# Altium schematic sheet Schematic_2023-08-02.schdoc
size 599 x 400 mm
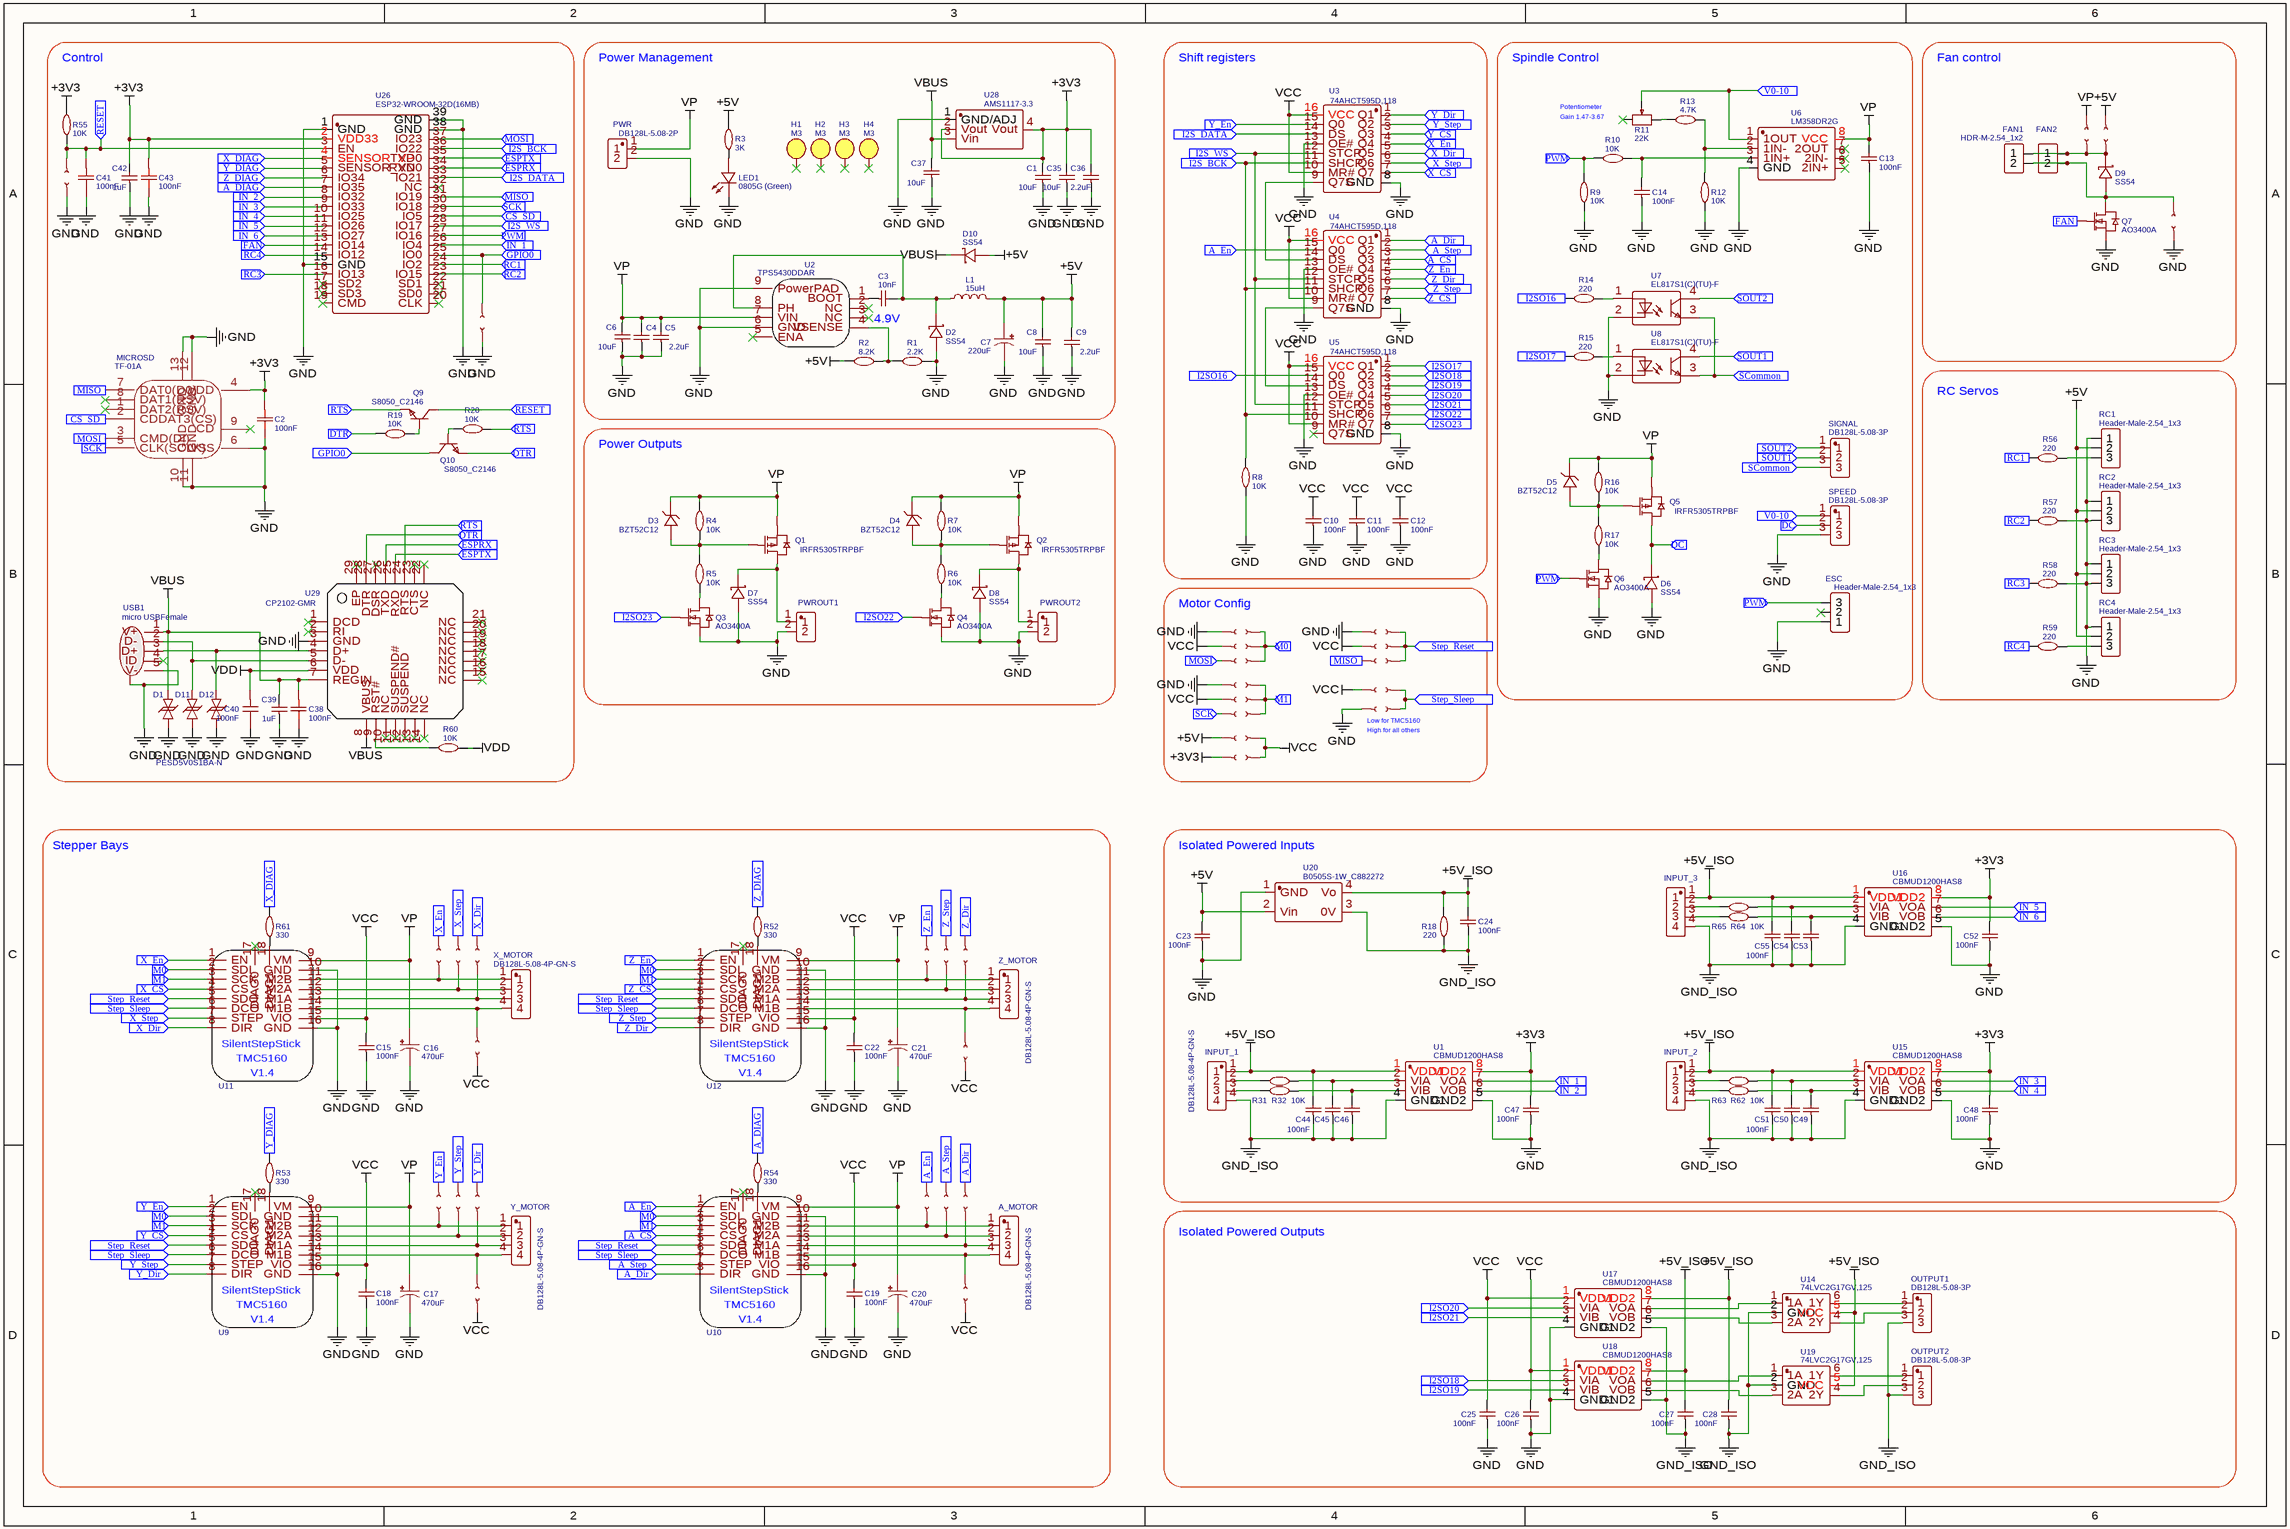
[diagram p0: Schematic_2023-08-02.schdoc]

## Parts
A_MOTOR  DB128L-5.08-4P-GN-S  [CONN-TH_4P-5.00_DB128L-5.0-4P-BU-S]
C1  10uF  [C1206]
C2  100nF  [C0603]
C3  10nF  [C0805]
C4  2.2uF  [C1206]  (value not drawn)
C5  2.2uF  [C1206]
C6  10uF  [C1206]
C7  220uF  [CAP-SMD_L7.3-W4.3-R-RD]
C8  10uF  [C1206]
C9  2.2uF  [C1206]
C10  100nF  [C0805]
C11  100nF  [C0805]
C12  100nF  [C0805]
C13  100nF  [C0805]
C14  100nF  [C0805]
C15  100nF  [C0805]
C16  470uF  [CAP-SMD_BD12.5-L13.0-W13.0-FD]
C17  470uF  [CAP-SMD_BD12.5-L13.0-W13.0-FD]
C18  100nF  [C0805]
C19  100nF  [C0805]
C20  470uF  [CAP-SMD_BD12.5-L13.0-W13.0-FD]
C21  470uF  [CAP-SMD_BD12.5-L13.0-W13.0-FD]
C22  100nF  [C0805]
C23  100nF  [C0805]
C24  100nF  [C0805]
C25  100nF  [C0805]
C26  100nF  [C0805]
C27  100nF  [C0805]
C28  100nF  [C0805]
C35  10uF  [C1206]
C36  2.2uF  [C1206]
C37  10uF  [C1206]
C38  100nF  [C0603]
C39  1uF  [C0603]
C40  100nF  [C0603]
C41  100nF  [C0603]
C42  1uF  [C0603]
C43  100nF  [C0603]
C44  100nF  [C0805]  (value not drawn)
C45  100nF  [C0805]
C46  100nF  [C0805]  (value not drawn)
C47  100nF  [C0805]
C48  100nF  [C0805]
C49  100nF  [C0805]  (value not drawn)
C50  100nF  [C0805]
C51  100nF  [C0805]  (value not drawn)
C52  100nF  [C0805]
C53  100nF  [C0805]  (value not drawn)
C54  100nF  [C0805]
C55  100nF  [C0805]  (value not drawn)
D1  PESD5V0S1BA-N  [SOD-323_L1.8-W1.3-LS2.5-BI]  (value not drawn)
D2  SS54  [SMA_L4.4-W2.8-LS5.4-R-RD]
D3  BZT52C12  [SOD-123_L2.7-W1.6-LS3.7-RD]
D4  BZT52C12  [SOD-123_L2.7-W1.6-LS3.7-RD]
D5  BZT52C12  [SOD-123_L2.7-W1.6-LS3.7-RD]
D6  SS54  [SMA_L4.4-W2.8-LS5.4-R-RD]
D7  SS54  [SMA_L4.4-W2.8-LS5.4-R-RD]
D8  SS54  [SMA_L4.4-W2.8-LS5.4-R-RD]
D9  SS54  [SMA_L4.4-W2.8-LS5.4-R-RD]
D10  SS54  [SMA_L4.4-W2.8-LS5.4-R-RD]
D11  PESD5V0S1BA-N  [SOD-323_L1.8-W1.3-LS2.5-BI]  (value not drawn)
D12  PESD5V0S1BA-N  [SOD-323_L1.8-W1.3-LS2.5-BI]
ESC  Header-Male-2.54_1x3  [HDR-TH_3P-P2.54-V-M-1]
FAN1  HDR-M-2.54_1x2  [HDR-M-2.54_1X2]
FAN2  HDR-M-2.54_1x2  [HDR-M-2.54_1X2]  (value not drawn)
H1  M3  [M3 CHASSIS]
H2  M3  [M3 CHASSIS]
H3  M3  [M3 CHASSIS]
H4  M3  [M3 CHASSIS]
INPUT_1  DB128L-5.08-4P-GN-S  [CONN-TH_4P-5.00_DB128L-5.0-4P-BU-S]
INPUT_2  DB128L-5.08-4P-GN-S  [CONN-TH_4P-5.00_DB128L-5.0-4P-BU-S]  (value not drawn)
INPUT_3  DB128L-5.08-4P-GN-S  [CONN-TH_4P-5.00_DB128L-5.0-4P-BU-S]  (value not drawn)
JP1  JUMPER-PAD-2  [JUMPER_SOLDER_2]  (value not drawn)
JP2  JUMPER-PAD-2  [JUMPER_SOLDER_2]  (value not drawn)
JP3  JUMPER-PAD-2  [JUMPER_SOLDER_2]  (value not drawn)
JP4  JUMPER-PAD-2  [JUMPER_SOLDER_2]  (value not drawn)
JP5  JUMPER-PAD-2  [JUMPER_SOLDER_2]  (value not drawn)
JP6  JUMPER-PAD-2  [JUMPER_SOLDER_2]  (value not drawn)
JP7  JUMPER-PAD-2  [JUMPER_SOLDER_2]  (value not drawn)
JP8  JUMPER-PAD-2  [JUMPER_SOLDER_2]  (value not drawn)
JP9  JUMPER-PAD-2  [JUMPER_SOLDER_2]  (value not drawn)
JP10  JUMPER-PAD-2  [JUMPER_SOLDER_2]  (value not drawn)
JP11  JUMPER-PAD-2  [JUMPER_SOLDER_2]  (value not drawn)
JP12  JUMPER-PAD-2  [JUMPER_SOLDER_2]  (value not drawn)
JP13  JUMPER-PAD-2  [JUMPER_SOLDER_2]  (value not drawn)
JP14  JUMPER-PAD-2  [JUMPER_SOLDER_2]  (value not drawn)
JP15  JUMPER-PAD-2  [JUMPER_SOLDER_2]  (value not drawn)
JP16  JUMPER-PAD-2  [JUMPER_SOLDER_2]  (value not drawn)
JP17  JUMPER-PAD-2  [JUMPER_SOLDER_2]  (value not drawn)
JP18  JUMPER-PAD-2  [JUMPER_SOLDER_2]  (value not drawn)
JP19  JUMPER-PAD-2  [JUMPER_SOLDER_2]  (value not drawn)
JP20  JUMPER-PAD-2  [JUMPER_SOLDER_2]  (value not drawn)
JP21  JUMPER-PAD-2  [JUMPER_SOLDER_2]  (value not drawn)
JP22  JUMPER-PAD-2  [JUMPER_SOLDER_2]  (value not drawn)
JP23  JUMPER-PAD-2  [JUMPER_SOLDER_2]  (value not drawn)
JP24  JUMPER-PAD-2  [JUMPER_SOLDER_2]  (value not drawn)
JP25  JUMPER-PAD-2  [JUMPER_SOLDER_2]  (value not drawn)
JP26  JUMPER-PAD-2  [JUMPER_SOLDER_2]  (value not drawn)
JP27  JUMPER-PAD-2  [JUMPER_SOLDER_2]  (value not drawn)
JP28  JUMPER-PAD-2  [JUMPER_SOLDER_2]  (value not drawn)
JP29  JUMPER-PAD-2  [JUMPER_SOLDER_2]  (value not drawn)
JP30  JUMPER-PAD-2  [JUMPER_SOLDER_2]  (value not drawn)
JP31  JUMPER-PAD-2  [JUMPER_SOLDER_2]  (value not drawn)
JP32  JUMPER-PAD-2  [JUMPER_SOLDER_2]  (value not drawn)
JP33  JUMPER-PAD-2  [JUMPER_SOLDER_2]  (value not drawn)
JP34  JUMPER-PAD-2  [JUMPER_SOLDER_2]  (value not drawn)
L1  15uH  [IND-SMD_L7.3-W6.6]
LED1  0805G (Green)  [LED0805-RD_GREEN]
MICROSD  TF-01A  [TF-SMD_TF-01A]
OUTPUT1  DB128L-5.08-3P  [CONN-TH_DB128L-5.08-3P]
OUTPUT2  DB128L-5.08-3P  [CONN-TH_DB128L-5.08-3P]
PWR  DB128L-5.08-2P  [CONN-TH_2P-P5.08_DB128L-5.08-2P]
PWROUT1  DB128L-5.08-2P  [CONN-TH_2P-P5.08_DB128L-5.08-2P]  (value not drawn)
PWROUT2  DB128L-5.08-2P  [CONN-TH_2P-P5.08_DB128L-5.08-2P]  (value not drawn)
Q1  IRFR5305TRPBF  [TO-252-3_L6.5-W5.8-P4.58-TR]
Q2  IRFR5305TRPBF  [TO-252-3_L6.5-W5.8-P4.58-TR]
Q3  AO3400A  [SOT-23-3_L2.9-W1.6-P1.90-LS2.8-BR]
Q4  AO3400A  [SOT-23-3_L2.9-W1.6-P1.90-LS2.8-BR]
Q5  IRFR5305TRPBF  [TO-252-3_L6.5-W5.8-P4.58-TR]
Q6  AO3400A  [SOT-23-3_L2.9-W1.6-P1.90-LS2.8-BR]
Q7  AO3400A  [SOT-23-3_L2.9-W1.6-P1.90-LS2.8-BR]
Q9  S8050_C2146  [SOT-23-3_L3.0-W1.7-P0.95-LS2.9-BR]
Q10  S8050_C2146  [SOT-23-3_L3.0-W1.7-P0.95-LS2.9-BR]
R1  2.2K  [R0805]
R2  8.2K  [R0805]
R3  3K  [R0805]
R4  10K  [R0805]
R5  10K  [R0805]
R6  10K  [R0805]
R7  10K  [R0805]
R8  10K  [R0805]
R9  10K  [R0805]
R10  10K  [R0805]
R11  22K  [RES-ADJ-SMD_VG039NCH]
R12  10K  [R0805]
R13  4.7K  [R0805]
R14  220  [R0805]
R15  220  [R0805]
R16  10K  [R0805]
R17  10K  [R0805]
R18  220  [R0805]
R19  10K  [R0603]
R20  10K  [R0603]
R31  10K  [R0805]  (value not drawn)
R32  10K  [R0805]
R52  330  [R0805]
R53  330  [R0805]
R54  330  [R0805]
R55  10K  [R0603]
R56  220  [R0805]
R57  220  [R0805]
R58  220  [R0805]
R59  220  [R0805]
R60  10K  [R0603]
R61  330  [R0805]
R62  10K  [R0805]
R63  10K  [R0805]  (value not drawn)
R64  10K  [R0805]
R65  10K  [R0805]  (value not drawn)
RC1  Header-Male-2.54_1x3  [HDR-TH_3P-P2.54-V-M-1]
RC2  Header-Male-2.54_1x3  [HDR-TH_3P-P2.54-V-M-1]
RC3  Header-Male-2.54_1x3  [HDR-TH_3P-P2.54-V-M-1]
RC4  Header-Male-2.54_1x3  [HDR-TH_3P-P2.54-V-M-1]
SIGNAL  DB128L-5.08-3P  [CONN-TH_DB128L-5.08-3P]
SPEED  DB128L-5.08-3P  [CONN-TH_DB128L-5.08-3P]
U1  CBMUD1200HAS8  [SOIC-8_L4.9-W3.9-P1.27-LS6.0-BL]
U2  TPS5430DDAR  [SOIC-8_L5.0-W4.0-P1.27-LS6.0-BL-EP2.0]
U3  74AHCT595D,118  [SOP-16_L10.0-W3.9-P1.27-LS6.0-BL]
U4  74AHCT595D,118  [SOP-16_L10.0-W3.9-P1.27-LS6.0-BL]
U5  74AHCT595D,118  [SOP-16_L10.0-W3.9-P1.27-LS6.0-BL]
U6  LM358DR2G  [SOIC-8_L5.0-W4.0-P1.27-LS6.0-BL]
U7  EL817S1(C)(TU)-F  [OPTO-SMD-4_L4.6-W6.5-P2.54-LS10.3-TL]
U8  EL817S1(C)(TU)-F  [OPTO-SMD-4_L4.6-W6.5-P2.54-LS10.3-TL]
U9  SilentStepStick_TMC5160_V1.4  [SILENTSTEPSTICK_TMC5160]  (value not drawn)
U10  SilentStepStick_TMC5160_V1.4  [SILENTSTEPSTICK_TMC5160]  (value not drawn)
U11  SilentStepStick_TMC5160_V1.4  [SILENTSTEPSTICK_TMC5160]  (value not drawn)
U12  SilentStepStick_TMC5160_V1.4  [SILENTSTEPSTICK_TMC5160]  (value not drawn)
U14  74LVC2G17GV,125  [SC-74-6_L3.0-W1.5-P0.95-LS2.8-BL]
U15  CBMUD1200HAS8  [SOIC-8_L4.9-W3.9-P1.27-LS6.0-BL]
U16  CBMUD1200HAS8  [SOIC-8_L4.9-W3.9-P1.27-LS6.0-BL]
U17  CBMUD1200HAS8  [SOIC-8_L4.9-W3.9-P1.27-LS6.0-BL]
U18  CBMUD1200HAS8  [SOIC-8_L4.9-W3.9-P1.27-LS6.0-BL]
U19  74LVC2G17GV,125  [SC-74-6_L3.0-W1.5-P0.95-LS2.8-BL]
U20  B0505S-1W_C882272  [PWRM-TH_BXXXXS-1WR3]
U26  ESP32-WROOM-32D(16MB)  [WIFIM-SMD_39P-L25.5-W18.0-P1.27-BL]
U28  AMS1117-3.3  [SOT-223-3_L6.5-W3.4-P2.30-LS7.0-BR]
U29  CP2102-GMR  [QFN-28_L5.0-W5.0-P0.50-BL-EP]
USB1  micro USBFemale  [MICRO-USB-SMD_5P-P0.65-H-F_C10418]
X_MOTOR  DB128L-5.08-4P-GN-S  [CONN-TH_4P-5.00_DB128L-5.0-4P-BU-S]
Y_MOTOR  DB128L-5.08-4P-GN-S  [CONN-TH_4P-5.00_DB128L-5.0-4P-BU-S]
Z_MOTOR  DB128L-5.08-4P-GN-S  [CONN-TH_4P-5.00_DB128L-5.0-4P-BU-S]

## Blocks framed on the sheet
Control: C2 C38-C43 D1 D11 D12 JP33 JP34 MICROSD Q9 Q10 R19 R20 R55 R60 U26 U29 USB1
Shift registers: C10-C12 R8 U3-U5
Spindle Control: C13 C14 D5 D6 ESC Q5 Q6 R9-R17 SIGNAL SPEED U6-U8
Fan control: D9 FAN1 FAN2 JP27-JP29 Q7
RC Servos: R56-R59 RC1-RC4
Power Outputs: D3 D4 D7 D8 PWROUT1 PWROUT2 Q1-Q4 R4-R7
Motor Config: JP5-JP14 JP30-JP32
Stepper Bays: A_MOTOR C15-C22 JP1-JP4 JP15-JP26 R52-R54 R61 U9-U12 X_MOTOR Y_MOTOR Z_MOTOR
Isolated Powered Inputs: C23 C24 C44-C55 INPUT_1-INPUT_3 R18 R31 R32 R62-R65 U1 U15 U16 U20
Isolated Powered Outputs: C25-C28 OUTPUT1 OUTPUT2 U14 U17-U19

## Ports
A_CS (in), A_DIAG (in), A_Dir (in), A_En (in), A_Step (in), CS_SD (in), DC (in), DTR (in), ESPRX (in), ESPTX (in), FAN (in), GPIO0 (in), I2S_BCK (in), I2S_DATA (in), I2S_WS (in), I2SO16 (in), I2SO17 (in), I2SO18 (in), I2SO19 (in), I2SO20 (in), I2SO21 (in), I2SO22 (in), I2SO23 (in), IN_1 (in), IN_2 (in), IN_3 (in), IN_4 (in), IN_5 (in), IN_6 (in), M0 (in), M1 (in), MISO (in), MOSI (in), PWM (in), RC1 (in), RC2 (in), RC3 (in), RC4 (in), RESET (in), RTS (in), SCK (in), SCommon (in), SOUT1 (in), SOUT2 (in), Step_Reset (in), Step_Sleep (in), V0-10 (in), X_CS (in), X_DIAG (in), X_Dir (in), X_En (in), X_Step (in), Y_CS (in), Y_DIAG (in), Y_Dir (in), Y_En (in), Y_Step (in), Z_CS (in), Z_DIAG (in), Z_Dir (in), Z_En (in), Z_Step (in)

## Nets
+3V3: C1.2 C2.2 C35.2 C36.2 C42.2 C43.2 C47.2 C48.2 C52.2 JP9.1 MICROSD.4(VDD) R55.2 U1.8(VDD2) U15.8(VDD2) U16.8(VDD2) U26.2(VDD33) U28.2(Vout) U28.4(Vout)
+5V: C7.1 C8.2 C9.2 C23.2 D10.1(A) JP10.1 JP28.2 L1.2 R2.1 R3.2 RC1.2 RC2.2 RC3.2 RC4.2 U20.2(Vin)
+5V_ISO: C24.2 C27.2 C28.2 C44.2 C51.2 C55.2 INPUT_1.1 INPUT_2.1 INPUT_3.1 R18.2 U1.1(VDD1) U14.5(VCC) U15.1(VDD1) U16.1(VDD1) U17.8(VDD2) U18.8(VDD2) U19.5(VCC) U20.4(Vo)
GND: C1.1 C2.1 C4.1 C5.1 C6.1 C7.2 C8.1 C9.1 C10.1 C11.1 C12.1 C13.1 C14.1 C15.1 C16.2 C17.2 C18.1 C19.1 C20.2 C21.2 C22.1 C23.1 C25.1 C26.1 C35.1 C36.1 C37.1 C38.1 C39.1 C40.1 C41.1 C42.1 C43.1 C47.1 C48.1 C52.1 D1.1 D2.1(A) D6.1(A) D7.1(A) D8.1(A) D11.1 D12.1 ESC.1 JP8.1 JP29.1 JP30.1 JP31.1 JP32.1 JP33.1 JP34.1 LED1.1(K) MICROSD.6(VSS) MICROSD.10(GND) MICROSD.11(GND) MICROSD.12(GND) MICROSD.13(GND) PWR.2 PWROUT1.2 PWROUT2.2 Q3.2(S) Q4.2(S) Q6.2(S) Q7.2(S) R1.2 R8.2 R9.2 R12.1 R57.2 R58.2 RC1.1 RC2.1 RC2.3 RC3.1 RC3.3 RC4.1 SPEED.3 U1.5(GND2) U2.6(GND) U2.9(PowerPAD) U3.8(GND) U3.13(OE#) U4.8(GND) U4.13(OE#) U5.8(GND) U5.13(OE#) U6.4(GND) U7.2(CAT) U8.2(CAT) U9.10(GND) U9.16(GND) U10.10(GND) U10.16(GND) U11.10(GND) U11.16(GND) U12.10(GND) U12.16(GND) U15.5(GND2) U16.5(GND2) U17.4(GND1) U18.4(GND1) U20.1(GND) U26.1(GND) U26.15(GND) U26.38(GND) U26.39(GND) U28.1(GND/ADJ) U29.3(GND) USB1.0(MTN) USB1.5(V-)
GND_ISO: C24.1 C27.1 C28.1 C44.1 C45.1 C46.1 C49.1 C50.1 C51.1 C53.1 C54.1 C55.1 INPUT_1.4 INPUT_2.4 INPUT_3.4 OUTPUT1.3 OUTPUT2.3 R18.1 U1.4(GND1) U14.2(GND) U15.4(GND1) U16.4(GND1) U17.5(GND2) U18.5(GND2) U19.2(GND) U20.3(0V)
VBUS: C37.2 C38.2 C39.2 D1.2 D10.2(K) U28.3(Vin) U29.7(REGIN) U29.8(VBUS) USB1.1(V+)
VCC: C10.2 C11.2 C12.2 C15.2 C18.2 C19.2 C22.2 C25.2 C26.2 JP1.1 JP5.1 JP7.1 JP9.2 JP10.2 JP11.1 JP13.1 JP18.1 JP22.1 JP26.1 U3.10(MR#) U3.16(VCC) U4.10(MR#) U4.16(VCC) U5.10(MR#) U5.16(VCC) U9.15(VIO) U10.15(VIO) U11.15(VIO) U12.15(VIO) U17.1(VDD1) U18.1(VDD1)
VDD: C40.2 R60.2 U29.6(VDD)
VP: C4.2 C5.2 C6.2 C13.2 C16.1 C17.1 C20.1 C21.1 D3.1(K) D4.1(K) D5.1(K) JP27.2 PWR.1 Q1.3(S) Q2.3(S) Q5.3(S) R4.1 R7.1 R16.1 U2.7(VIN) U6.8(VCC) U9.9(VM) U10.9(VM) U11.9(VM) U12.9(VM)
A_CS: U4.3(Q3) U10.4(CS) ; port A_CS
A_DIAG: R54.2 U26.7(IO35) ; port A_DIAG
A_Dir: JP25.2 U4.1(Q1) U10.8(DIR) ; port A_Dir
A_En: JP23.2 U4.15(Q0) U10.1(EN) ; port A_En
A_Step: JP24.2 U4.2(Q2) U10.7(STEP) ; port A_Step
CS_SD: MICROSD.2(CDDAT3(CS)) U26.29(IO5) ; port CS_SD
DC: D6.2(K) Q5.2(D) SPEED.2 ; port DC
DTR: Q10.2(E) R19.2 U29.28(DTR) ; port DTR
ESPRX: U26.34(RXD0) U29.26(TXD) ; port ESPRX
ESPTX: U26.35(TXD0) U29.25(RXD) ; port ESPTX
FAN: Q7.1(G) U26.13(IO14) ; port FAN
GPIO0: JP34.2 Q10.3(C) U26.25(IO0) ; port GPIO0
I2S_BCK: R8.1 U3.11(SHCP) U4.11(SHCP) U5.11(SHCP) U26.36(IO22) ; port I2S_BCK
I2S_DATA: U3.14(DS) U26.33(IO21) ; port I2S_DATA
I2S_WS: U3.12(STCP) U4.12(STCP) U5.12(STCP) U26.28(IO17) ; port I2S_WS
I2SO16: R14.1 U5.15(Q0) ; port I2SO16
I2SO17: R15.1 U5.1(Q1) ; port I2SO17
I2SO18: U5.2(Q2) U18.2(VIA) ; port I2SO18
I2SO19: U5.3(Q3) U18.3(VIB) ; port I2SO19
I2SO20: U5.4(Q4) U17.2(VIA) ; port I2SO20
I2SO21: U5.5(Q5) U17.3(VIB) ; port I2SO21
I2SO22: Q4.1(G) U5.6(Q6) ; port I2SO22
I2SO23: Q3.1(G) U5.7(Q7) ; port I2SO23
IN_1: U1.7(VOA) U26.26(IO4) ; port IN_1
IN_2: U1.6(VOB) U26.8(IO32) ; port IN_2
IN_3: U15.7(VOA) U26.9(IO33) ; port IN_3
IN_4: U15.6(VOB) U26.10(IO25) ; port IN_4
IN_5: U16.7(VOA) U26.11(IO26) ; port IN_5
IN_6: U16.6(VOB) U26.12(IO27) ; port IN_6
M0: JP11.2 JP12.2 JP30.2 U9.2(SDI) U10.2(SDI) U11.2(SDI) U12.2(SDI) ; port M0
M1: JP13.2 JP14.2 JP31.2 U9.3(SCK) U10.3(SCK) U11.3(SCK) U12.3(SCK) ; port M1
MISO: JP6.1 MICROSD.7(DAT0(D0)) U26.31(IO19) ; port MISO
MOSI: JP12.1 MICROSD.3(CMD(DI)) U26.37(IO23) ; port MOSI
PWM: ESC.3 Q6.1(G) R9.1 R10.1 U26.27(IO16) ; port PWM
RC1: R56.1 U26.24(IO2) ; port RC1
RC2: R57.1 U26.23(IO15) ; port RC2
RC3: R58.1 U26.16(IO13) ; port RC3
RC4: R59.1 U26.14(IO12) ; port RC4
RESET: C41.2 JP33.2 Q9.3(C) R55.1 U26.3(EN) ; port RESET
RTS: Q9.2(E) R20.1 U29.24(RTS) ; port RTS
SCK: JP14.1 MICROSD.5(CLK(SCLK)) U26.30(IO18) ; port SCK
SCommon: SIGNAL.3 U7.3(EM) U8.3(EM) ; port SCommon
SOUT1: SIGNAL.2 U8.4(COL) ; port SOUT1
SOUT2: SIGNAL.1 U7.4(COL) ; port SOUT2
Step_Reset: JP5.2 JP6.2 JP32.2 U9.5(SDO) U10.5(SDO) U11.5(SDO) U12.5(SDO) ; port Step_Reset
Step_Sleep: JP7.2 JP8.2 U9.6(DCO) U10.6(DCO) U11.6(DCO) U12.6(DCO) ; port Step_Sleep
V0-10: R11.2 SPEED.1 U6.1(1OUT) ; port V0-10
X_CS: U3.7(Q7) U11.4(CS) ; port X_CS
X_DIAG: R61.2 U26.4(SENSOR_VP) ; port X_DIAG
X_Dir: JP3.2 U3.5(Q5) U11.8(DIR) ; port X_Dir
X_En: JP4.2 U3.4(Q4) U11.1(EN) ; port X_En
X_Step: JP2.2 U3.6(Q6) U11.7(STEP) ; port X_Step
Y_CS: U3.3(Q3) U9.4(CS) ; port Y_CS
Y_DIAG: R53.2 U26.5(SENSOR_VN) ; port Y_DIAG
Y_Dir: JP21.2 U3.1(Q1) U9.8(DIR) ; port Y_Dir
Y_En: JP19.2 U3.15(Q0) U9.1(EN) ; port Y_En
Y_Step: JP20.2 U3.2(Q2) U9.7(STEP) ; port Y_Step
Z_CS: U4.7(Q7) U12.4(CS) ; port Z_CS
Z_DIAG: R52.2 U26.6(IO34) ; port Z_DIAG
Z_Dir: JP17.2 U4.5(Q5) U12.8(DIR) ; port Z_Dir
Z_En: JP15.2 U4.4(Q4) U12.1(EN) ; port Z_En
Z_Step: JP16.2 U4.6(Q6) U12.7(STEP) ; port Z_Step
NetA_MOTOR_1: A_MOTOR.1 JP23.1 U10.11(M2B)
NetA_MOTOR_2: A_MOTOR.2 JP24.1 U10.12(M2A)
NetA_MOTOR_3: A_MOTOR.3 JP25.1 U10.13(M1A)
NetA_MOTOR_4: A_MOTOR.4 JP26.2 U10.14(M1B)
NetC3_1: C3.1 U2.1(BOOT)
NetC3_2: C3.2 D2.2(K) L1.1 U2.8(PH)
NetC14_2: C14.2 R10.2 U6.3(1IN+)
NetC45_2: C45.2 R31.1 U1.2(VIA)
NetC46_2: C46.2 R32.1 U1.3(VIB)
NetC49_2: C49.2 R62.1 U15.3(VIB)
NetC50_2: C50.2 R63.1 U15.2(VIA)
NetC53_2: C53.2 R64.1 U16.3(VIB)
NetC54_2: C54.2 R65.1 U16.2(VIA)
NetD3_2: D3.2(A) Q1.1(G) R4.2 R5.1
NetD4_2: D4.2(A) Q2.1(G) R6.1 R7.2
NetD5_2: D5.2(A) Q5.1(G) R16.2 R17.1
NetD7_2: D7.2(K) PWROUT1.1 Q1.2(D)
NetD8_2: D8.2(K) PWROUT2.1 Q2.2(D)
NetD9_1: D9.1(A) FAN1.2 FAN2.2 JP29.2 Q7.3(D)
NetD9_2: D9.2(K) FAN1.1 FAN2.1 JP27.1 JP28.1
NetD11_2: D11.2 U29.5(D-) USB1.2(D-)
NetD12_2: D12.2 U29.4(D+) USB1.3(D+)
NetINPUT_1_2: INPUT_1.2 R31.2
NetINPUT_1_3: INPUT_1.3 R32.2
NetINPUT_2_2: INPUT_2.2 R63.2
NetINPUT_2_3: INPUT_2.3 R62.2
NetINPUT_3_2: INPUT_3.2 R65.2
NetINPUT_3_3: INPUT_3.3 R64.2
NetJP1_2: JP1.2 U11.14(M1B) X_MOTOR.4
NetJP2_1: JP2.1 U11.12(M2A) X_MOTOR.2
NetJP3_1: JP3.1 U11.13(M1A) X_MOTOR.3
NetJP4_1: JP4.1 U11.11(M2B) X_MOTOR.1
NetJP15_1: JP15.1 U12.11(M2B) Z_MOTOR.1
NetJP16_1: JP16.1 U12.12(M2A) Z_MOTOR.2
NetJP17_1: JP17.1 U12.13(M1A) Z_MOTOR.3
NetJP18_2: JP18.2 U12.14(M1B) Z_MOTOR.4
NetJP19_1: JP19.1 U9.11(M2B) Y_MOTOR.1
NetJP20_1: JP20.1 U9.12(M2A) Y_MOTOR.2
NetJP21_1: JP21.1 U9.13(M1A) Y_MOTOR.3
NetJP22_2: JP22.2 U9.14(M1B) Y_MOTOR.4
NetLED1_2: LED1.2(A) R3.1
NetOUTPUT1_1: OUTPUT1.1 U14.6(1Y)
NetOUTPUT1_2: OUTPUT1.2 U14.4(2Y)
NetOUTPUT2_1: OUTPUT2.1 U19.6(1Y)
NetOUTPUT2_2: OUTPUT2.2 U19.4(2Y)
NetQ3_3: Q3.3(D) R5.2
NetQ4_3: Q4.3(D) R6.2
NetQ6_3: Q6.3(D) R17.2
NetQ9_1: Q9.1(B) R19.1
NetQ10_1: Q10.1(B) R20.2
NetR1_1: R1.1 R2.2 U2.4(VSENSE)
NetR11_3: R11.3 R13.2
NetR12_2: R12.2 R13.1 U6.2(1IN-)
NetR14_2: R14.2 U7.1(AN)
NetR15_2: R15.2 U8.1(AN)
NetR52_1: R52.1 U12.18(DIAG1)
NetR53_1: R53.1 U9.18(DIAG1)
NetR54_1: R54.1 U10.18(DIAG1)
NetR56_2: R56.2 RC1.3
NetR59_2: R59.2 RC4.3
NetR60_1: R60.1 U29.9(RST#)
NetR61_1: R61.1 U11.18(DIAG1)
NetU3_9: U3.9(Q7S) U4.14(DS)
NetU4_9: U4.9(Q7S) U5.14(DS)
NetU14_1: U14.1(1A) U17.7(VOA)
NetU14_3: U14.3(2A) U17.6(VOB)
NetU18_6: U18.6(VOB) U19.3(2A)
NetU18_7: U18.7(VOA) U19.1(1A)

Not connected (* = marked no-connect by the designer): ESC 2*; H1 1*; H2 1*; H3 1*; H4 1*; MICROSD 1(DAT2(RSV))* 8(DAT1(RSV))* 9(CD)*; R11 1*; U2 2(NC)* 3(NC)* 5(ENA)*; U5 9(Q7S)*; U6 5(2IN+)* 6(2IN-)* 7(2OUT)*; U9 17(DIAG0)*; U10 17(DIAG0)*; U11 17(DIAG0)*; U12 17(DIAG0)*; U26 17(SD2)* 18(SD3)* 19(CMD)* 20(CLK)* 21(SD0)* 22(SD1)* 32(NC)*; U29 1(DCD)* 2(RI)* 10(NC)* 11(SUSPEND#)* 12(SUSPEND)* 13(NC)* 14(NC)* 15(NC)* 16(NC)* 17(NC)* 18(NC)* 19(NC)* 20(NC)* 21(NC)* 22(NC)* 23(CTS)* 27(DSR)* 29(EP)*; USB1 4(ID)*

## Notes on the sheet
- Power Management
- Gain 1.47-3.67
- Potentiometer
- 4.9V
- (near JP8) Low for TMC5160
- (near JP8) High for all others
- (in symbol SilentStepStick_TMC5160_V1.4) SilentStepStick; TMC5160; V1.4

## Library data of the parts
A_MOTOR INPUT_1-INPUT_3 X_MOTOR Y_MOTOR Z_MOTOR = DB128L-5.08-4P-GN-S: Manufacturer: DIBO; Contributor: LCSC; Supplier: LCSC; Supplier Part: C2827883; Manufacturer Part: DB128L-5.08-4P-GN-S; JLCPCB Part Class: Extended Part; spicePre: U; spiceSymbolName: DB128L-5.0-4P-BU-S
C1 C6 C8 C35 C37 = 10uF: Manufacturer Part: CL31A106KBHNNNE; Manufacturer: SAMSUNG; nameAlias: Capacitance; Supplier: LCSC; Supplier Part: C13585; JLCPCB Part Class: Basic Part; spicePre: C; spiceSymbolName: CL31A106KBHNNNE
C2 C38 C40 C41 C43 = 100nF: Manufacturer: YAGEO; Manufacturer Part: CC0603KRX7R9BB104; nameAlias: Capacitance; Supplier: LCSC; Supplier Part: C14663; JLCPCB Part Class: Basic Part; spicePre: C; spiceSymbolName: CC0603KRX7R9BB104
C3 = 10nF: Manufacturer Part: CL21B103KBANNNC; Manufacturer: SAMSUNG; nameAlias: Capacitance; Supplier: LCSC; Supplier Part: C1710; JLCPCB Part Class: Basic Part; spicePre: C; spiceSymbolName: CL21B103KBANNNC
C4 C5 C9 C36 = 2.2uF: Manufacturer Part: CL31B225KBHNNNE; Manufacturer: SAMSUNG; nameAlias: Capacitance; Supplier: LCSC; Supplier Part: C50254; JLCPCB Part Class: Basic Part; spicePre: C; spiceSymbolName: CL31B225KBHNNNE
C7 = 220uF: Manufacturer: TORCH; Manufacturer Part: CA45-D-10V-220μF-K; nameAlias: Capacitance; Contributor: LCSC; Supplier: LCSC; Supplier Part: C171665; JLCPCB Part Class: Extended Part; spicePre: C; spiceSymbolName: CA45-D-10V-220μF-K
C10-C15 C18 C19 C22-C28 C44-C55 = 100nF: Manufacturer Part: CC0805KRX7R9BB104; Manufacturer: YAGEO; nameAlias: Capacitance; Supplier: LCSC; Supplier Part: C49678; JLCPCB Part Class: Basic Part; spicePre: C; spiceSymbolName: CC0805KRX7R9BB104
C16 C17 C20 C21 = 470uF: Manufacturer: Changzhou Huawei Elec; Manufacturer Part: VT1H471MI135000CE0; nameAlias: Capacitance; Contributor: LCSC; Supplier: LCSC; Supplier Part: C191227; JLCPCB Part Class: Extended Part; spicePre: C; spiceSymbolName: VT1H471MI135000CE0
C39 C42 = 1uF: Manufacturer Part: CL10A105KB8NNNC; Manufacturer: SAMSUNG; nameAlias: Capacitance; Supplier: LCSC; Supplier Part: C15849; JLCPCB Part Class: Basic Part; spicePre: C; spiceSymbolName: CL10A105KB8NNNC
D1 D11 D12 = PESD5V0S1BA-N: Manufacturer: Bourne Semicon (Shenzhen); Contributor: LCSC; Supplier: LCSC; Supplier Part: C314260; Manufacturer Part: PESD5V0S1BA-N; JLCPCB Part Class: Extended Part; spicePre: D; spiceSymbolName: PESD5V0S1BA-N
D2 D6-D10 = SS54: Manufacturer: MDD; Supplier: LCSC; Manufacturer Part: SS54; Supplier Part: C22452; JLCPCB Part Class: Basic Part; spicePre: D; spiceSymbolName: SS54_C22452
D3-D5 = BZT52C12: Manufacturer: MDD; Contributor: LCSC; Supplier Part: C173429; Supplier: LCSC; Manufacturer Part: BZT52C12; JLCPCB Part Class: Extended Part; spicePre: D; spiceSymbolName: BZT52C12
ESC RC1-RC4 = Header-Male-2.54_1x3: Manufacturer: BOOMELE; Manufacturer Part: Header2.54mm 1*3P; Supplier: LCSC; Supplier Part: C429954; JLCPCB Part Class: Extended Part; spicePre: H; spiceSymbolName: Header-Male-2.54_1x3
FAN1 FAN2 = HDR-M-2.54_1x2: Contributor: LCEDA_Lib; Supplier Part: C124375; Supplier: LCSC; spicePre: J; spiceSymbolName: HDR-M-2.54_1x2
H1-H4 = M3: Contributor: maitrai; spicePre: H; spiceSymbolName: M3
JP1-JP34 = JUMPER-PAD-2: Contributor: IPR SYSTEMS EDA; spicePre: J; spiceSymbolName: JUMPER-PAD-2
L1 = 15uH: Manufacturer: SXN; Manufacturer Part: SMMS0630-150M; nameAlias: Inductance; Supplier: LCSC; Supplier Part: C128693; JLCPCB Part Class: Extended Part; spicePre: L; spiceSymbolName: SMMS0630-150M
LED1 = 0805G (Green): Manufacturer: KENTO; Supplier: LCSC; Manufacturer Part: 0805G (Green); Supplier Part: C2297; JLCPCB Part Class: Basic Part; spicePre: L; spiceSymbolName: 0805G (Green)
MICROSD = TF-01A: Manufacturer: HRO; Supplier: LCSC; Manufacturer Part: TF-01A; Supplier Part: C91145; JLCPCB Part Class: Extended Part; spicePre: C; spiceSymbolName: TF-01A
OUTPUT1 OUTPUT2 SIGNAL SPEED = DB128L-5.08-3P: Manufacturer: DIBO; Contributor: LCSC; Supplier: LCSC; Supplier Part: C395869; Manufacturer Part: DB128L-5.08-3P; JLCPCB Part Class: Extended Part; spicePre: U; spiceSymbolName: DB128L-5.08-3P
PWR PWROUT1 PWROUT2 = DB128L-5.08-2P: Manufacturer: DIBO; Contributor: LCSC; Supplier: LCSC; Supplier Part: C395868; Manufacturer Part: DB128L-5.08-2P; JLCPCB Part Class: Extended Part; spicePre: U; spiceSymbolName: DB128L-5.08-2P
Q1 Q2 Q5 = IRFR5305TRPBF: Manufacturer: IR; Supplier: LCSC; Manufacturer Part: IRFR5305TRPBF; Supplier Part: C2624; JLCPCB Part Class: Extended Part; spicePre: Q; spiceSymbolName: IRFR5305TRPBF
Q3 Q4 Q6 Q7 = AO3400A: Manufacturer: AOS; Supplier: LCSC; Manufacturer Part: AO3400A; Supplier Part: C20917; JLCPCB Part Class: Basic Part; spicePre: Q; spiceSymbolName: AO3400A
Q9 Q10 = S8050_C2146: Manufacturer: CJ; Manufacturer Part: S8050; Supplier: LCSC; Supplier Part: C2146; JLCPCB Part Class: Basic Part; spicePre: Q; spiceSymbolName: S8050_C2146
R1 = 2.2K: Manufacturer: UniOhm; Manufacturer Part: 0805W8F2201T5E; nameAlias: Resistance (Ohms); Supplier: LCSC; Supplier Part: C17520; JLCPCB Part Class: Basic Part; spicePre: R; spiceSymbolName: 0805W8F2201T5E
R2 = 8.2K: Manufacturer: UniOhm; Manufacturer Part: 0805W8F8201T5E; nameAlias: Resistance (Ohms); Supplier: LCSC; Supplier Part: C17828; JLCPCB Part Class: Basic Part; spicePre: R; spiceSymbolName: 0805W8F8201T5E
R3 = 3K: Manufacturer: UniOhm; Manufacturer Part: 0805W8F3001T5E; nameAlias: Resistance (Ohms); Supplier: LCSC; Supplier Part: C17661; JLCPCB Part Class: Basic Part; spicePre: R; spiceSymbolName: 0805W8F3001T5E
R4-R10 R12 R16 R17 R31 R32 R62-R65 = 10K: Manufacturer: UniOhm; Manufacturer Part: 0805W8F1002T5E; nameAlias: Resistance (Ohms); Supplier: LCSC; Supplier Part: C17414; JLCPCB Part Class: Basic Part; spicePre: R; spiceSymbolName: 0805W8F1002T5E
R11 = 22K: Manufacturer: HDK; Manufacturer Part: VG039NCHXTB223; nameAlias: Resistance (Ohms); Contributor: LCSC; Supplier: LCSC; Resistance(Ohms): 22K; Supplier Part: C128552; JLCPCB Part Class: Extended Part; spicePre: R; spiceSymbolName: VG039NCHXTB223
R13 = 4.7K: Manufacturer: UniOhm; Manufacturer Part: 0805W8F4701T5E; nameAlias: Resistance (Ohms); Supplier: LCSC; Supplier Part: C17673; JLCPCB Part Class: Basic Part; spicePre: R; spiceSymbolName: 0805W8F4701T5E
R14 R15 R18 R56-R59 = 220: Manufacturer: UniOhm; Manufacturer Part: 0805W8F2200T5E; nameAlias: Resistance (Ohms); Supplier: LCSC; Supplier Part: C17557; JLCPCB Part Class: Basic Part; spicePre: R; spiceSymbolName: 0805W8F2200T5E
R19 R20 R55 R60 = 10K: Manufacturer: UniOhm; Manufacturer Part: 0603WAF1002T5E; nameAlias: Resistance (Ohms); Supplier: LCSC; Supplier Part: C25804; JLCPCB Part Class: Basic Part; spicePre: R; spiceSymbolName: 0603WAF1002T5E
R52-R54 R61 = 330: Manufacturer: UniOhm; Manufacturer Part: 0805W8F3300T5E; nameAlias: Resistance (Ohms); Supplier: LCSC; Supplier Part: C17630; JLCPCB Part Class: Basic Part; spicePre: R; spiceSymbolName: 0805W8F3300T5E
U1 U15-U18 = CBMUD1200HAS8: Manufacturer: Corebai(芯佰微); Contributor: LCSC; Supplier: LCSC; Supplier Part: C476471; Manufacturer Part: CBMuD1200HAS8; JLCPCB Part Class: Extended Part; spicePre: U; spiceSymbolName: CBMUD1200HAS8
U2 = TPS5430DDAR: Manufacturer: TI; Supplier: LCSC; Manufacturer Part: TPS5430DDAR; Supplier Part: C9864; JLCPCB Part Class: Basic Part; spicePre: U; spiceSymbolName: TPS5430DDAR
U3-U5 = 74AHCT595D,118: Manufacturer: Nexperia; Contributor: LCSC; Supplier: LCSC; Supplier Part: C503428; Manufacturer Part: 74AHCT595D,118; JLCPCB Part Class: Extended Part; spicePre: U; spiceSymbolName: 74AHCT595D,118
U6 = LM358DR2G: Manufacturer: ON; spicePre: X; Supplier: LCSC; Manufacturer Part: LM358DR2G; Supplier Part: C7950; JLCPCB Part Class: Basic Part; spiceSymbolName: LM358DR2G
U7 U8 = EL817S1(C)(TU)-F: Manufacturer: EVERLIGHT; Supplier: LCSC; Manufacturer Part: EL817S1(C)(TU)-F; Supplier Part: C106900; JLCPCB Part Class: Basic Part; spicePre: U; spiceSymbolName: EL817S1(C)(TU)-F
U9-U12 = SilentStepStick_TMC5160_V1.4: Contributor: philipp.maack; spicePre: U; spiceSymbolName: SilentStepStick_TMC5160_V1.4
U14 U19 = 74LVC2G17GV,125: Manufacturer: Nexperia; Contributor: LCSC; Supplier: LCSC; Supplier Part: C513289; Manufacturer Part: 74LVC2G17GV,125; JLCPCB Part Class: Extended Part; spicePre: U; spiceSymbolName: 74LVC2G17GV,125
U20 = B0505S-1W_C882272: Manufacturer: VISOM; Contributor: LCSC; Supplier: LCSC; Supplier Part: C882272; Manufacturer Part: B0505S-1W; JLCPCB Part Class: Extended Part; spicePre: U; spiceSymbolName: B0505S-1W_C882272
U26 = ESP32-WROOM-32D(16MB): Manufacturer: Espressif Systems; Contributor: LCSC; Supplier: LCSC; Supplier Part: C529578; Manufacturer Part: ESP32-WROOM-32D(16MB); JLCPCB Part Class: Extended Part; spicePre: U; spiceSymbolName: ESP32-WROOM-32D(16MB)
U28 = AMS1117-3.3: Manufacturer: AMS; sourceId: dwIGgezVh; timeStamp: 1476261164; Supplier: LCSC; Manufacturer Part: AMS1117-3.3; Supplier Part: C6186; JLCPCB Part Class: Basic Part; spicePre: U; spiceSymbolName: AMS1117-3.3
U29 = CP2102-GMR: Manufacturer: SILICON LABS; Supplier: LCSC; Manufacturer Part: CP2102-GMR; Supplier Part: C6568; JLCPCB Part Class: Basic Part; spicePre: U; spiceSymbolName: CP2102-GMR
USB1 = micro USBFemale: Manufacturer: ValuePro; Supplier: LCSC; Manufacturer Part: micro USBFemale; Supplier Part: C10418; JLCPCB Part Class: Extended Part; spicePre: U; spiceSymbolName: micro USBFemale